# EasyEDA Pro project ProPrj_Arduino_Contest_2025_2025-11-19.epro, board Sensor_Module_Rev_2
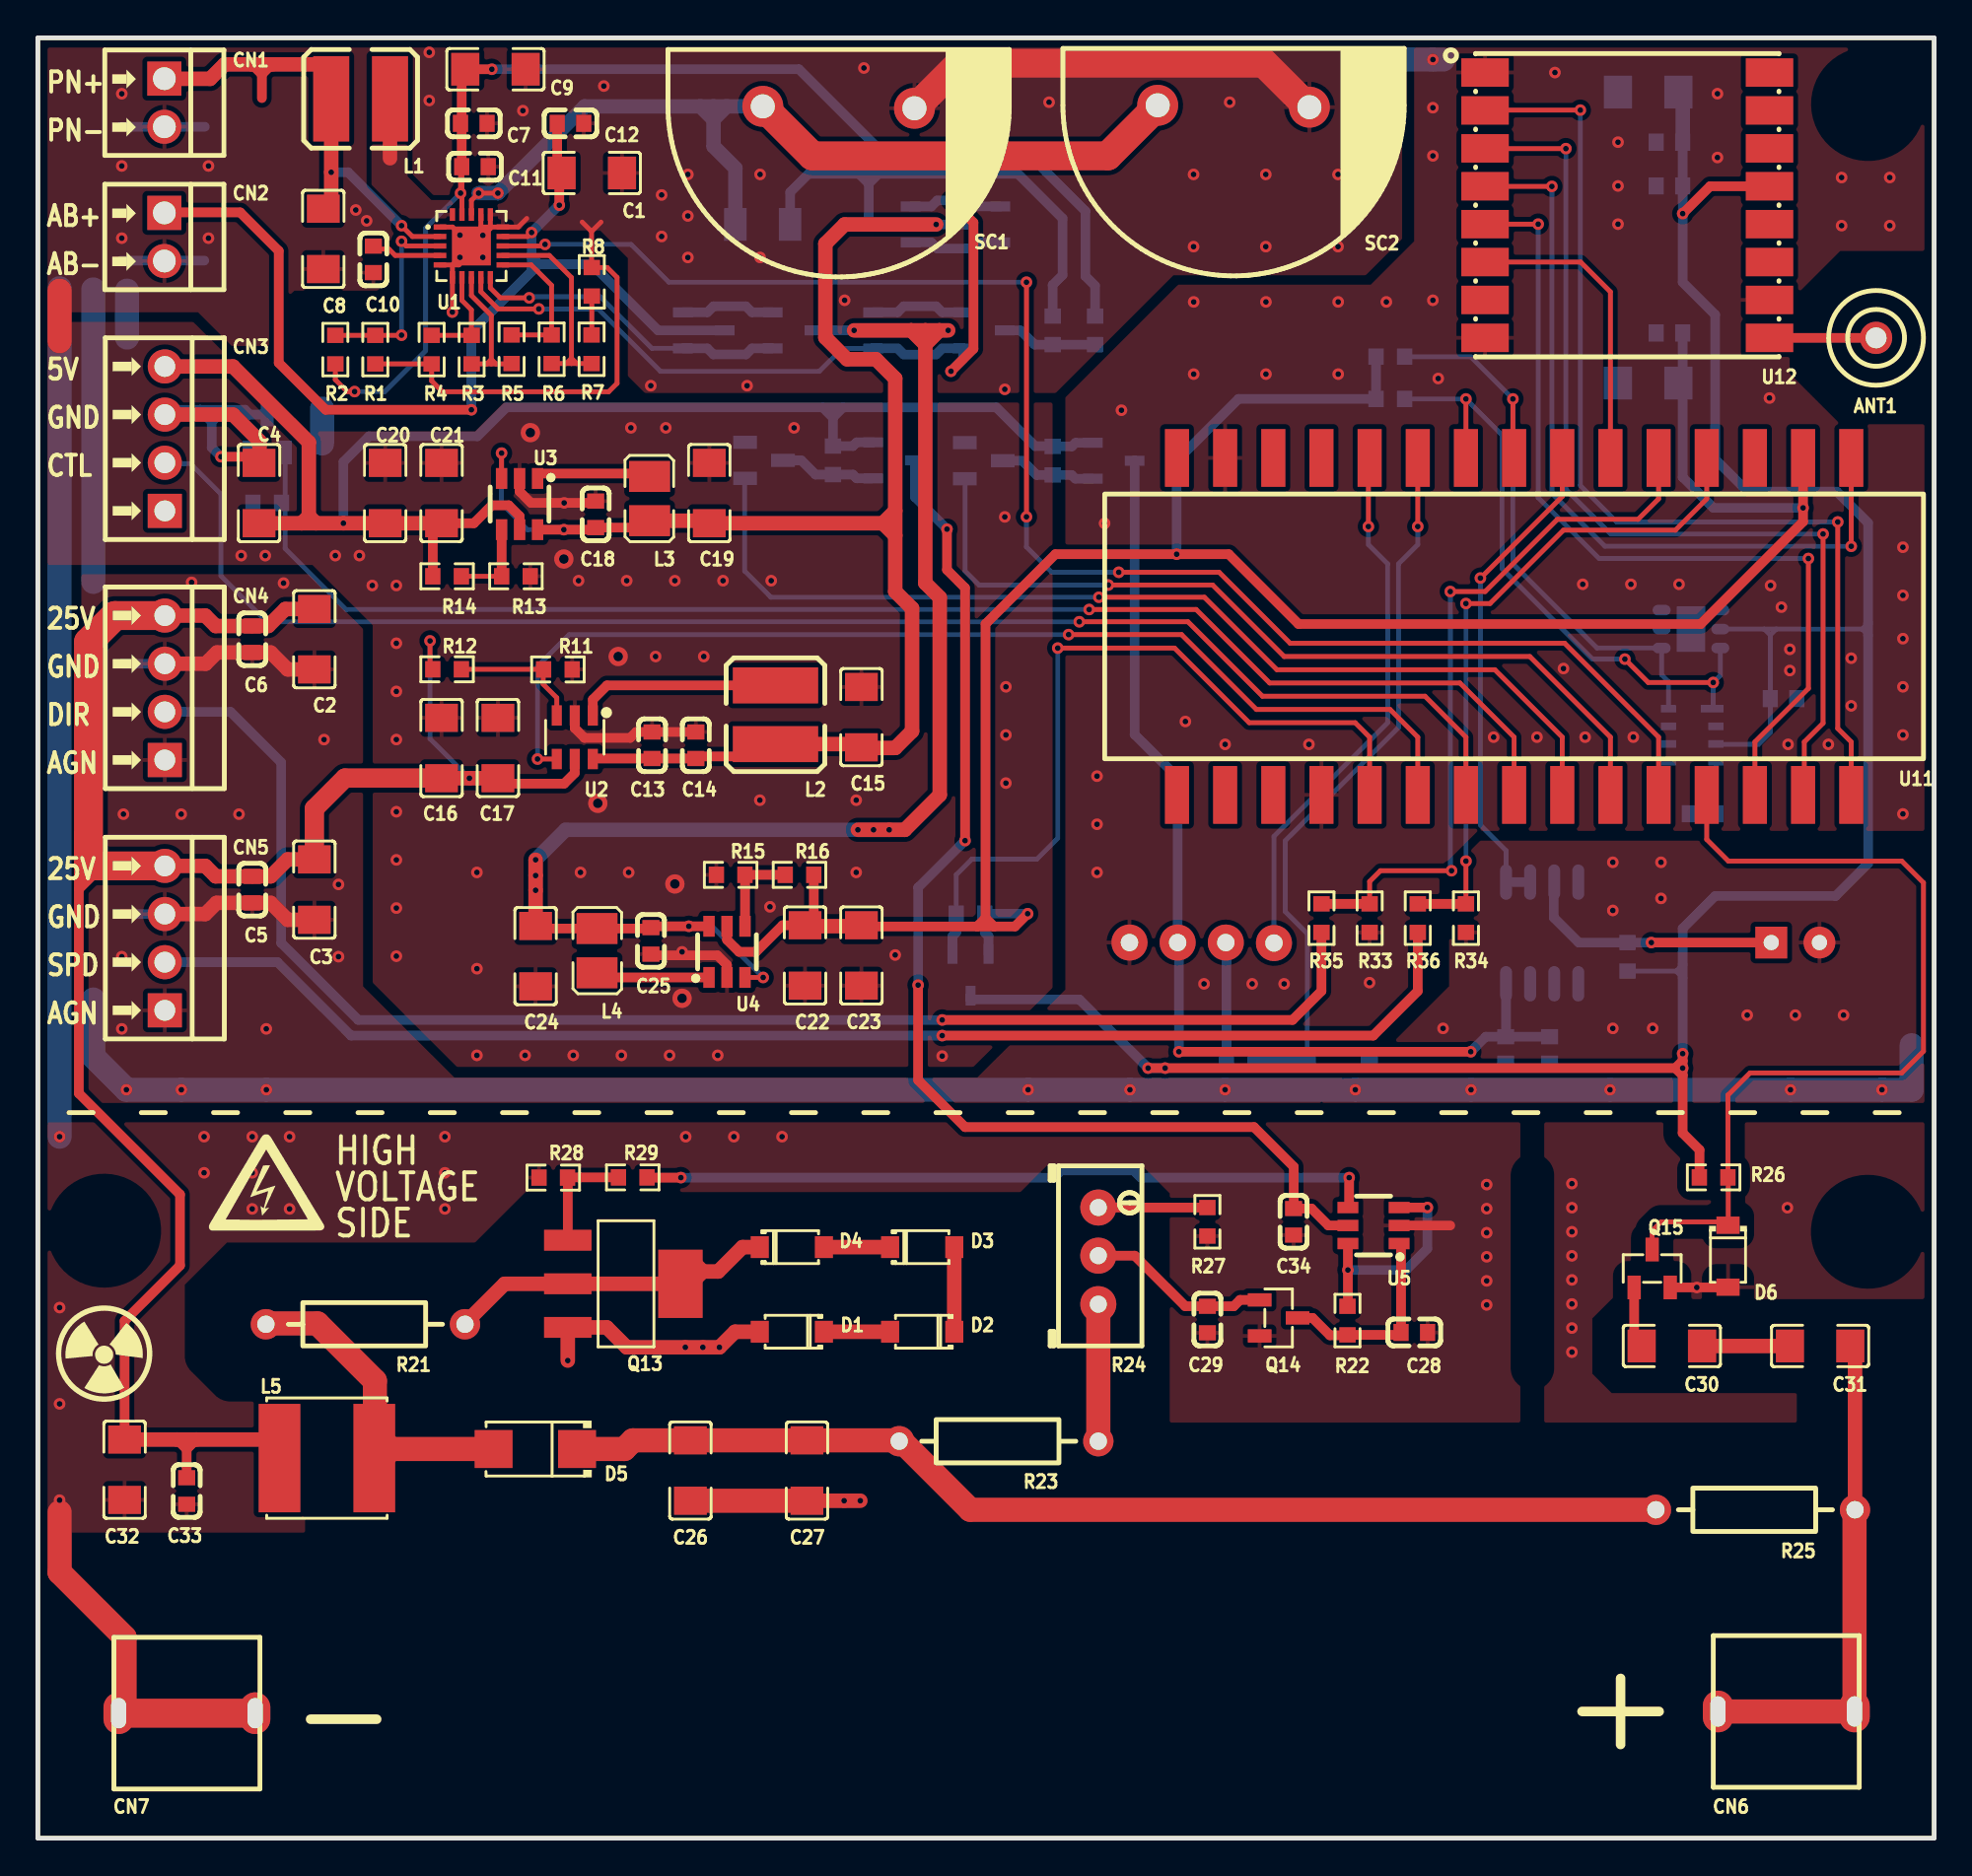
[diagram p21: board, top side]
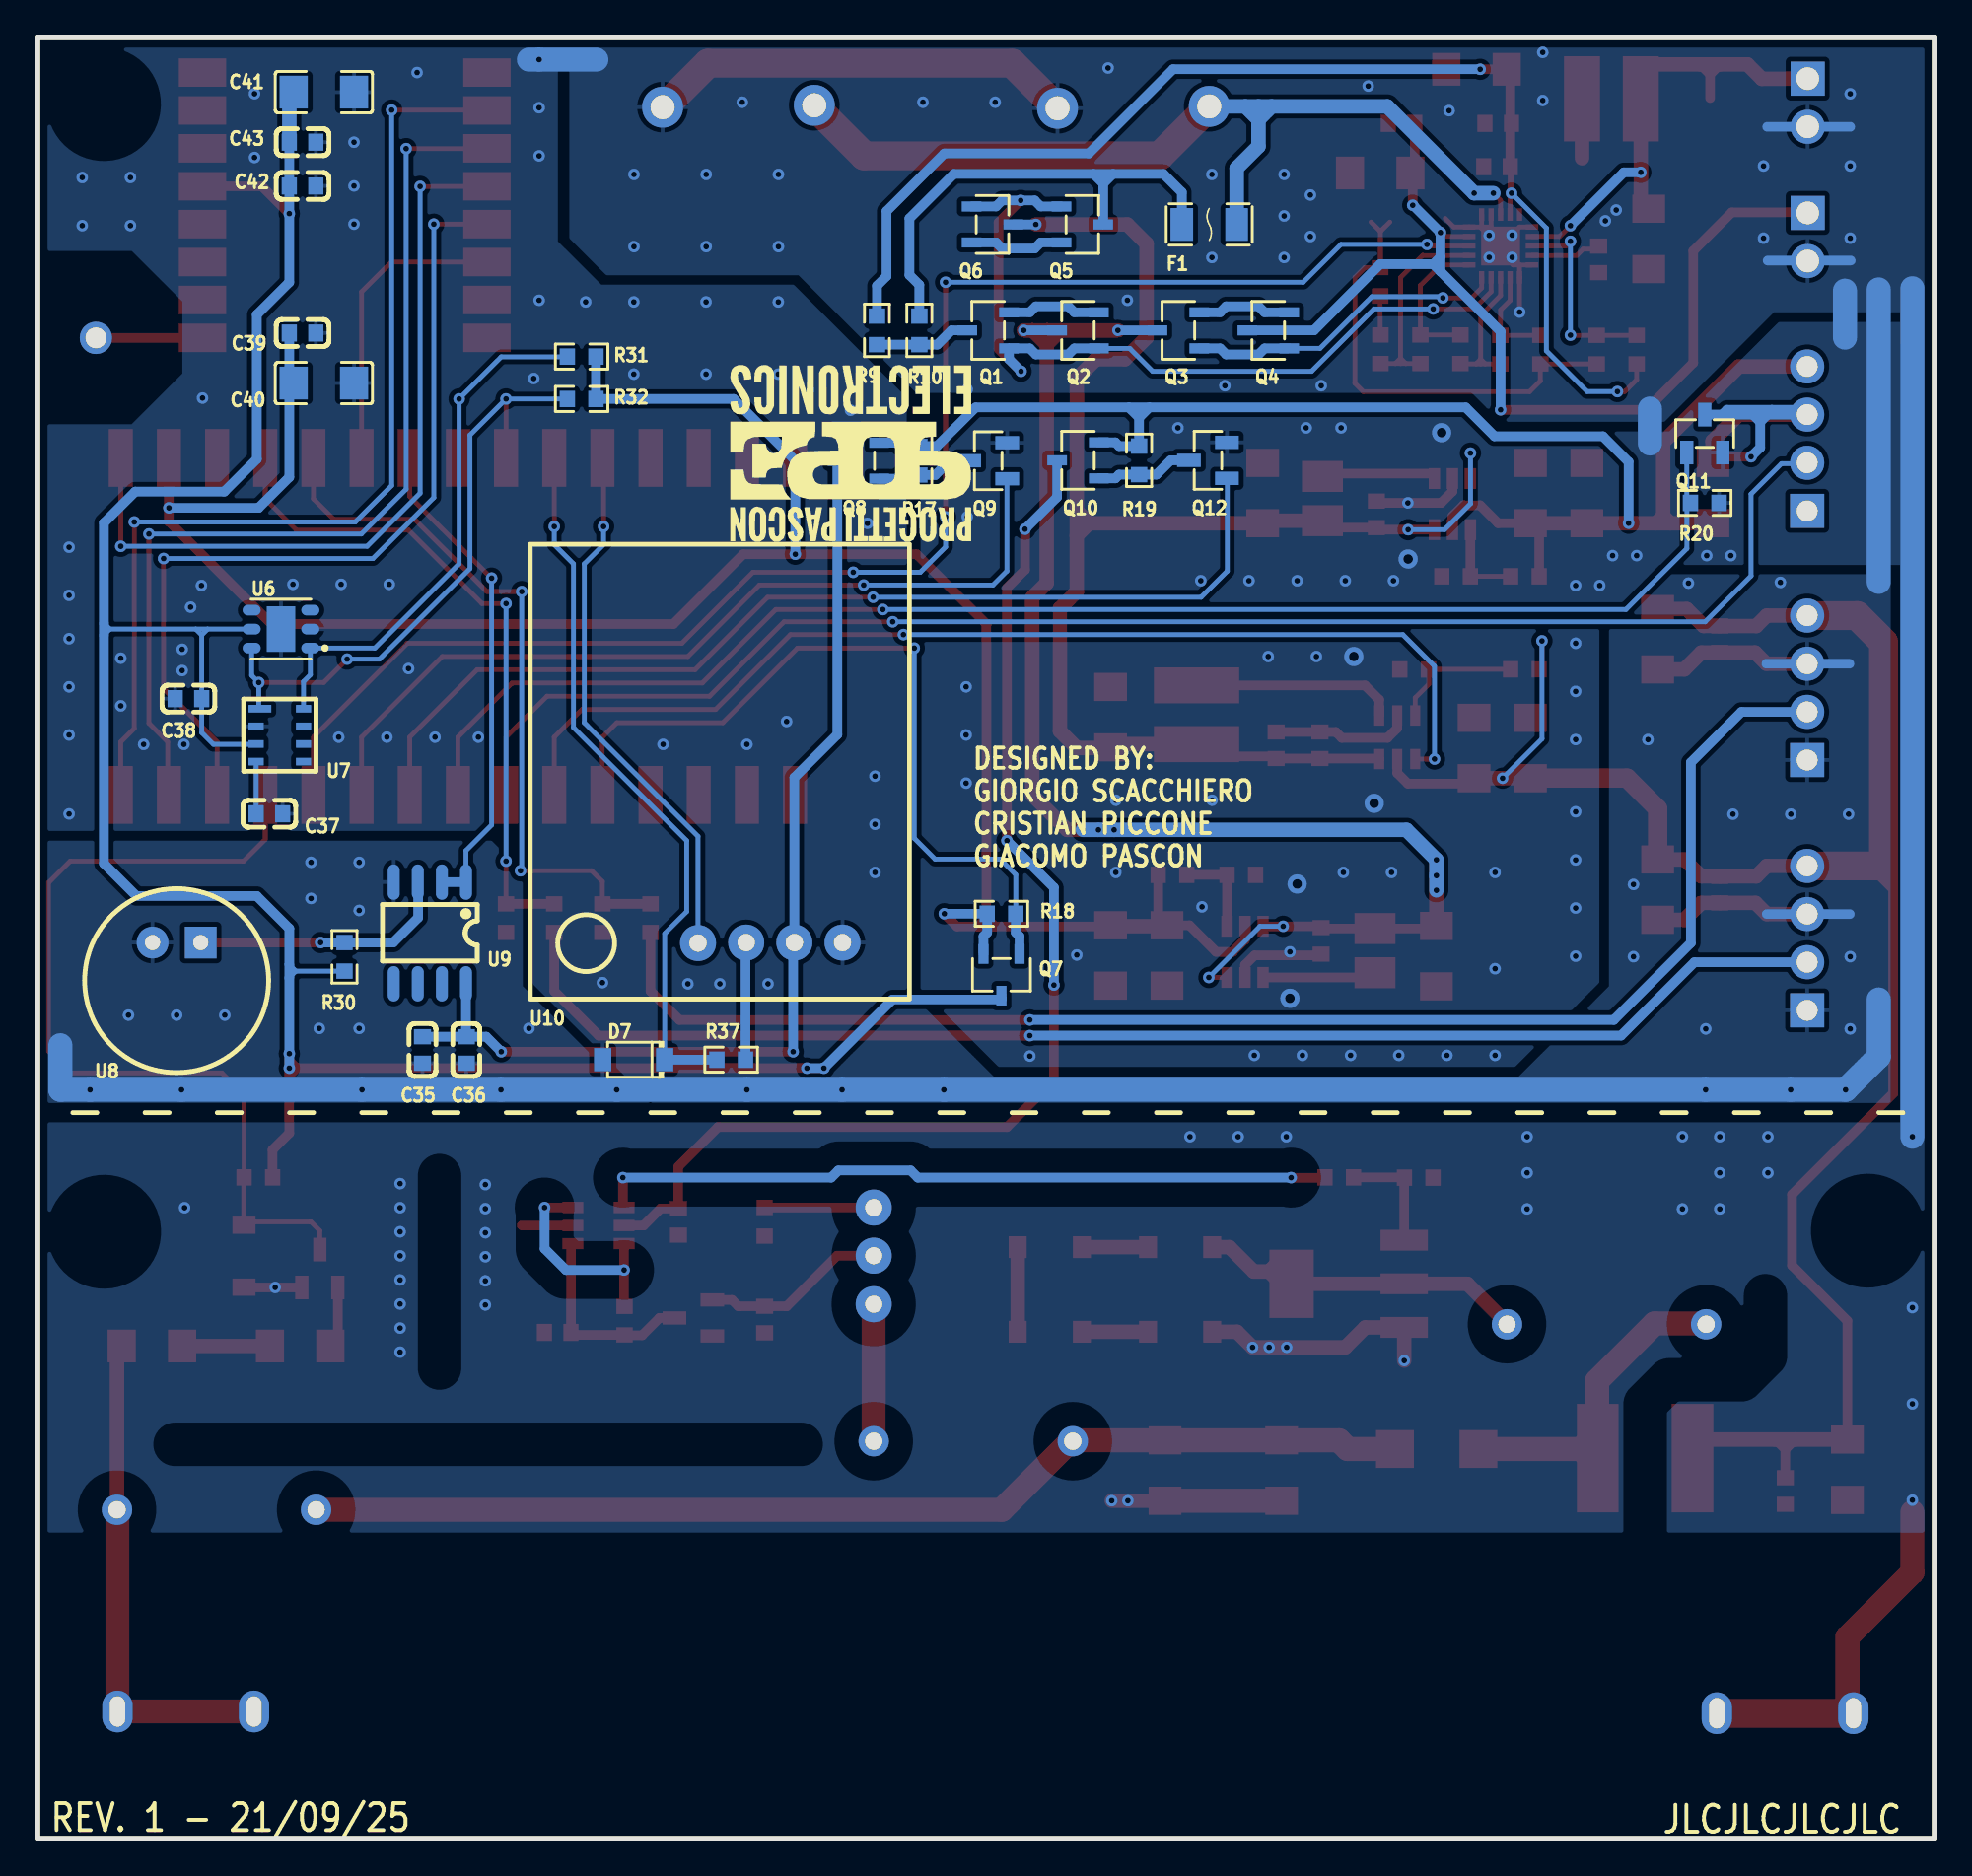
[diagram p22: board, bottom side, seen from below]

Outline 100 x 94.98 mm; copper layers: Top Layer, Bottom Layer. Coordinates in mm from the lower left corner of the outline.
Outline path: 0,94.98 100,94.98 100,0 0,0 0,94.98
Stack: Top Layer 0.035mm / Dielectric1 1.51mm FR4 er 4.5 / Bottom Layer 0.035mm

## Design rules (mm)
template: Custom Config
spacing copperThickness1oz (default): track to track 0.152, other pairs 0.152 to 0.3
spacing copperThickness2oz: track to track 0.203, other pairs 0.152 to 0.3
track width copperThickness1oz (default): min 0.127, default 0.254, max 2.54
track width copperThickness2oz: min 0.203, default 0.254, max 2.54
differential pair differentialPair (default): width min 0.127, default 0.254, max 2.54; gap min 0.152, default 0.152
via viaSize (default): diameter min 0.305, default 0.61, max 10.16; hole min 0.152, default 0.305, max 9.779
net $2N7577 uses traceRegion
pour e1770 uses Geiger_Logic_Copper
pour e2021 uses Geiger_Power_Copper

## Placement (name value [footprint] x y rotation side)
ANT1  VG868SNX18-5W2  [ANT-TH_VG868SNX18-5W2]  96.94 79.16 0 top
C1  4.7uF  [C1206]  29.21 87.86 180 top
C2  4.7uF  [C1206]  14.58 63.26 90 top
C3  4.7uF  [C1206]  14.58 50.04 90 top
C4  4.7uF  [C1206]  11.66 70.97 270 top
C5  100nF  [C0603]  11.3 50.04 90 top
C6  100nF  [C0603]  11.3 63.26 90 top
C7  100nF  [C0603]  22.99 90.47 180 top
C8  4.7uF  [C1206]  15.05 84.38 90 top
C9  4.7uF  [C1206]  24.13 93.33 180 top
C10  100pF  [C0603]  17.69 83.3 270 top
C11  100pF  [C0603]  23.05 88.19 180 top
C12  100pF  [C0603]  28.09 90.47 0 top
C13  100pF  [C0603]  32.39 57.66 270 top
C14  100nF  [C0603]  34.7 57.66 270 top
C15  4.7uF  [C1206]  43.43 59.14 270 top
C16  4.7uF  [C1206]  21.29 57.51 270 top
C17  4.7uF  [C1206]  24.26 57.51 270 top
C18  100nF  [C0603]  29.41 69.85 270 top
C19  4.7uF  [C1206]  35.41 70.97 270 top
C20  4.7uF  [C1206]  18.31 70.97 270 top
C21  4.7uF  [C1206]  21.29 70.97 270 top
C22  4.7uF  [C1206]  40.46 46.57 90 top
C23  4.7uF  [C1206]  43.43 46.57 90 top
C24  4.7uF  [C1206]  26.25 46.53 90 top
C25  100nF  [C0603]  32.33 47.34 90 top
C26  1nF  [C1206]  34.41 19.39 90 top
C27  1nF  [C1206]  40.56 19.39 90 top
C28  10pF  [C0603]  72.59 26.68 180 top
C29  100pF  [C0603]  61.68 27.36 90 top
C30  10pF  [C1206]  86.17 25.97 0 top
C31  10pF  [C1206]  93.99 25.97 0 top
C32  4.7uF  [C1206]  4.57 19.44 90 top
C33  100nF  [C0603]  7.84 18.31 90 top
C34  100nF  [C0603]  66.22 32.52 90 top
C35  100nF  [C0603]  79.72 41.58 90 bottom
C36  100pF  [C0603]  77.41 41.58 90 bottom
C37  100nF  [C0603]  87.79 54.05 0 bottom
C38  100nF  [C0603]  92.06 60.12 180 bottom
C39  100nF  [C0603]  86.04 79.41 180 bottom
C40  4.7uF  [C1206]  84.92 76.77 180 bottom
C41  4.7uF  [C1206]  84.92 92.12 0 bottom
C42  100pF  [C0603]  86.04 87.17 0 bottom
C43  100nF  [C0603]  86.04 89.48 0 bottom
CN1  DB125-2.54-2P-GN-S  [CONN-TH_DB125-2.54-2P-GN]  6.67 91.56 270 top
CN2  DB125-2.54-2P-GN-S  [CONN-TH_DB125-2.54-2P-GN]  6.67 84.48 270 top
CN3  DB125-2.54-4P-GN-S  [CONN-TH_DB125-2.54-4P-GN]  6.69 73.84 90 top
CN4  DB125-2.54-4P-GN-S  [CONN-TH_DB125-2.54-4P-GN]  6.69 60.69 90 top
CN5  DB125-2.54-4P-GN-S  [CONN-TH_DB125-2.54-4P-GN]  6.69 47.49 90 top
CN6  XF-007  [FUSE-TH_XF-007]  92.2 6.68 180 top
CN7  XF-007  [FUSE-TH_XF-007]  7.86 6.59 0 top
D1  BZD27C200P  [SOD-123_L2.8-W1.8-LS3.7-RD]  39.76 26.72 180 top
D2  BZD27C200P  [SOD-123_L2.8-W1.8-LS3.7-RD]  46.64 26.72 180 top
D3  BZD27C200P  [SOD-123_L2.8-W1.8-LS3.7-RD]  46.64 31.18 0 top
D4  BZD27C200P  [SOD-123_L2.8-W1.8-LS3.7-RD]  39.76 31.18 0 top
D5  RS1M  [SMA_L4.3-W2.6-LS5.2-RD]  26.23 20.53 180 top
D6  BZT52C3V3  [SOD-123_L2.7-W1.6-LS3.7-RD]  89.13 30.7 270 top
D7  BZT52C3V3  [SOD-123_L2.7-W1.6-LS3.7-RD]  68.58 41.07 0 bottom
F1  CFS12V3T2R50  [F1206]  38.23 85.14 0 bottom
L1  22uH  [IND-SMD_L4.5-W4.0]  17.02 91.77 0 top
L2  22uH  [IND-SMD_L4.5-W4.0]  38.9 59.27 270 top
L3  2.2uH  [L1008]  32.26 70.68 90 top
L4  2.2uH  [L1008]  29.49 46.82 270 top
L5  1mH  [IND-SMD_L6.0-W6.0]  15.24 20.05 0 top
Q1  DO2301E-Q  [SOT-23-3_L3.0-W1.7-P0.95-LS2.9-BR]  49.89 79.55 180 bottom
Q2  DO2301E-Q  [SOT-23-3_L3.0-W1.7-P0.95-LS2.9-BR]  45.15 79.55 180 bottom
Q3  DO2301E-Q  [SOT-23-3_L3.0-W1.7-P0.95-LS2.9-BR]  39.85 79.55 180 bottom
Q4  DO2301E-Q  [SOT-23-3_L3.0-W1.7-P0.95-LS2.9-BR]  35.11 79.55 180 bottom
Q5  DO2301E-Q  [SOT-23-3_L3.0-W1.7-P0.95-LS2.9-BR]  44.92 85.14 0 bottom
Q6  DO2301E-Q  [SOT-23-3_L3.0-W1.7-P0.95-LS2.9-BR]  49.66 85.14 0 bottom
Q7  DO2301E-Q  [SOT-23-3_L3.0-W1.7-P0.95-LS2.9-BR]  49.18 45.55 90 bottom
Q8  DO2301E-Q  [SOT-23-3_L3.0-W1.7-P0.95-LS2.9-BR]  56.74 72.67 180 bottom
Q9  5N10-MS  [SOT-23-3_L2.9-W1.3-P1.90-LS2.4-BL-1]  49.88 72.67 90 bottom
Q10  DO2301E-Q  [SOT-23-3_L3.0-W1.7-P0.95-LS2.9-BR]  45.15 72.69 180 bottom
Q11  5N10-MS  [SOT-23-3_L2.9-W1.3-P1.90-LS2.4-BL-1]  12.09 74.11 180 bottom
Q12  5N10-MS  [SOT-23-3_L2.9-W1.3-P1.90-LS2.4-BL-1]  38.29 72.69 90 bottom
Q13  SP05N100TC  [SOT-223-3_L6.5-W3.4-P2.30-LS7.0-BR-1]  30.91 29.25 180 top
Q14  5N10-MS  [SOT-23-3_L2.9-W1.3-P1.90-LS2.4-BL-1]  65.43 27.45 270 top
Q15  S8050-J3Y  [SOT-23-3_L2.9-W1.3-P0.95-LS2.4-BR-1]  85.13 30.05 270 top
R1  0Ω  [R0603]  17.79 78.54 90 top
R2  0Ω  [R0603]  15.68 78.54 270 top
R3  4.12MΩ  [R0603]  22.87 78.54 90 top
R4  7.87MΩ  [R0603]  20.76 78.54 270 top
R5  1.5MΩ  [R0603]  24.98 78.56 270 top
R6  3.9MΩ  [R0603]  27.09 78.56 90 top
R7  3.32MΩ  [R0603]  29.2 78.56 90 top
R8  3.32MΩ  [R0603]  29.21 82.11 90 top
R9  0Ω  [R0603]  55.75 79.55 270 bottom
R10  0Ω  [R0603]  53.52 79.55 270 bottom
R11  75kΩ  [R0603]  27.42 61.66 180 top
R12  2.32MΩ  [R0603]  21.58 61.67 180 top
R13  100kΩ  [R0603]  25.21 66.58 180 top
R14  887kΩ  [R0603]  21.58 66.58 180 top
R15  82kΩ  [R0603]  36.53 50.82 0 top
R16  453kΩ  [R0603]  40.16 50.82 0 top
R17  1MΩ  [R0603]  53.52 72.67 270 bottom
R18  1MΩ  [R0603]  49.18 48.77 180 bottom
R19  1MΩ  [R0603]  41.93 72.69 270 bottom
R20  1MΩ  [R0603]  12.09 70.45 180 bottom
R21  100Ω  [RES-TH_BD2.2-L6.5-P10.50-D0.6]  17.27 27.11 180 top
R22  1MΩ  [R0603]  69.06 27.3 90 top
R23  10MΩ  [RES-TH_BD2.2-L6.5-P10.50-D0.6]  50.67 20.94 180 top
R24  100kΩ  [RES-ADJ-TH_3P-L9.5-W4.9-P2.50-L_3296W]  55.92 30.72 270 top
R25  10MΩ  [RES-TH_BD2.2-L6.5-P10.50-D0.6]  90.58 17.32 180 top
R26  100kΩ  [R0603]  88.37 34.86 180 top
R27  0Ω  [R0603]  61.68 32.52 90 top
R28  1MΩ  [R0603]  27.18 34.85 180 top
R29  0Ω  [R0603]  31.37 34.86 0 top
R30  2.2kΩ  [R0603]  83.83 46.5 270 bottom
R31  100kΩ  [R0603]  71.32 78.17 180 bottom
R32  100kΩ  [R0603]  71.32 75.93 180 bottom
R33  33kΩ  [R0603]  70.23 48.54 90 top
R34  33kΩ  [R0603]  75.31 48.54 90 top
R35  17.4kΩ  [R0603]  67.69 48.54 270 top
R36  17.4kΩ  [R0603]  72.77 48.54 270 top
R37  330Ω  [R0603]  63.44 41.07 180 bottom
SC1  -  [BIGCAP_BUP002R8L107FA]  42.23 91.37 0 top
SC2  -  [BIGCAP_BUP002R8L107FA]  63.06 91.43 0 top
U1  BQ25505RGRR  [VQFN-20_L3.5-W3.5-P0.50-TL-EP]  22.86 84 0 top
U2  TLV61046ADBVR  [SOT-23-6_L2.9-W1.6-P0.95-LS2.8-BL]  28.31 58.08 180 top
U3  TLV61070ADBVR  [SOT-23-6_L2.9-W1.6-P0.95-LS2.8-BR]  25.4 70.39 90 top
U4  TLV61070ADBVR  [SOT-23-6_L2.9-W1.6-P0.95-LS2.8-BR]  36.34 46.76 270 top
U5  SN74LVC2G14DBVR  [SOT-23-6_L2.9-W1.6-P0.95-LS2.8-BR]  70.44 32.32 0 top
U6  HDC1080DMBR  [SENSOR-SMD_HDC1080DMBR]  87.18 63.79 0 bottom
U7  WF183DE 15BA L8B T&R  [LGA-8_L3.8-W3.8-P0.93-BL]  87.24 58.19 180 bottom
U8  GMI9745P-48DB  [MIC-TH_BD9.7-P2.54-D0.8-L-FD]  92.68 47.25 0 bottom
U9  BA4558F-E2  [SOP-8_L4.9-W3.9-P1.27-LS6.0-BL]  79.33 47.76 0 bottom
U10  -  [Saiya_SYP16]  54.04 44.27 90 bottom
U11  -  [Arduino_NANO_ESP32]  96.27 71.55 270 top
U12  868MHz  [COMM-SMD_LORA1276-C1-915MHZ]  83.82 86.16 0 top

## Footprints (pads in the part's own frame, mm; a bottom-side part is the same pattern mirrored in y, then rotated)
ANT-TH_VG868SNX18-5W2
  round 1.7 hole 1.1: 1(0,0)
Arduino_NANO_ESP32
  rect 3.048x1.27 smd: 1(-1.27,-0.635) 2(-1.27,-3.175) 3(-1.27,-5.715) 4(-1.27,-8.255) 5(-1.27,-10.795) 6(-1.27,-13.335) 7(-1.27,-15.875) 8(-1.27,-18.415) 9(-1.27,-20.955) 10(-1.27,-23.495) 11(-1.27,-26.035) 12(-1.27,-28.575) 13(-1.27,-31.115) 14(-1.27,-33.655) 15(-1.27,-36.195) 16(16.51,-0.635) 17(16.51,-3.175) 18(16.51,-5.715) 19(16.51,-8.255) 20(16.51,-10.795) 21(16.51,-13.335) 22(16.51,-15.875) 23(16.51,-18.415) 24(16.51,-20.955) 25(16.51,-23.495) 26(16.51,-26.035) 27(16.51,-28.575) 28(16.51,-31.115) 29(16.51,-33.655) 30(16.51,-36.195)
BIGCAP_BUP002R8L107FA
  round 2.159 hole 1.27: 1(-4,0) 2(4,-0.1)
C0603
  rect 0.8x0.9 smd: 1(-0.7,0) 2(0.7,0)
C1206
  rect 1.485x1.728 smd: 1(-1.593,0) 2(1.593,0)
COMM-SMD_LORA1276-C1-915MHZ
  rect 2.5x1.5 smd: 1(-7.5,7) 2(-7.5,5) 3(-7.5,3) 4(-7.5,1) 5(-7.5,-1) 6(-7.5,-3) 7(-7.5,-5) 8(-7.5,-7) 9(7.5,-7) 10(7.5,-5) 11(7.5,-3) 12(7.5,-1) 13(7.5,1) 14(7.5,3) 15(7.5,5) 16(7.5,7)
CONN-TH_DB125-2.54-2P-GN
  rect 1.8x1.8 hole 1.2: 1(-1.27,0)
  round 1.8 hole 1.2: 2(1.27,0)
CONN-TH_DB125-2.54-4P-GN
  rect 1.8x1.8 hole 1.1: 1(-3.81,0)
  round 1.8 hole 1.1: 2(-1.27,0) 3(1.27,0) 4(3.81,0)
F1206
  rect 1.19x1.728 smd: 1(-1.445,0) 2(1.445,0)
FUSE-TH_XF-007
  oval 1.6x2.2 hole 0.8x1.6: 1(-3.6,0) 1(3.6,0)
IND-SMD_L4.5-W4.0
  rect 1.9x4.5 smd: 1(-1.55,0) 2(1.55,0)
IND-SMD_L6.0-W6.0
  rect 2.2x5.72 smd: 1(-2.5,0) 2(2.5,0)
L1008
  rect 1.635x2.16 smd: 1(-1.167,0) 2(1.167,0)
LGA-8_L3.8-W3.8-P0.93-BL
  rect 1.2x0.4 smd: 1(-1.05,1.395)
  rect 0.8x0.4 smd: 2(-1.25,0.465) 3(-1.25,-0.465) 4(-1.25,-1.395) 5(1.25,-1.395) 6(1.25,-0.465) 7(1.25,0.465) 8(1.25,1.395)
MIC-TH_BD9.7-P2.54-D0.8-L-FD
  rect 1.677x1.677 hole 0.8: 1(-1.27,0)
  round 1.677 hole 0.8: 2(1.27,0)
R0603
  rect 0.806x0.864 smd: 1(-0.753,0) 2(0.753,0)
RES-ADJ-TH_3P-L9.5-W4.9-P2.50-L_3296W
  round 1.9 hole 0.9: 1(-2.55,0) 2(-0.01,0) 3(2.55,0)
RES-TH_BD2.2-L6.5-P10.50-D0.6
  round 1.6 hole 0.914: 1(-5.25,0) 2(5.25,0)
Saiya_SYP16
  round 1.9 hole 0.914x0.9: 1(2.955,11.15) 2(2.981,8.611) 3(2.981,6.071) 4(2.981,3.53)
SENSOR-SMD_HDC1080DMBR
  oval 0.95x0.56 smd: 1(-1.548,1) 2(-1.548,0) 3(-1.548,-1) 4(1.548,-1) 5(1.548,0) 6(1.548,1)
  rect 1.5x2.4 smd: 7(0,0)
SMA_L4.3-W2.6-LS5.2-RD
  rect 2x2 smd: 1(-2.2,0) 2(2.2,0)
SOD-123_L2.7-W1.6-LS3.7-RD
  rect 0.91x1.22 smd: 1(-1.635,0) 2(1.635,0)
SOD-123_L2.8-W1.8-LS3.7-RD
  rect 0.95x1.15 smd: 1(-1.692,0) 2(1.692,0)
SOP-8_L4.9-W3.9-P1.27-LS6.0-BL
  oval 0.63x1.865 smd: 1(-1.905,-2.683) 2(-0.635,-2.683) 3(0.635,-2.683) 4(1.905,-2.683) 5(1.905,2.683) 6(0.635,2.683) 7(-0.635,2.683) 8(-1.905,2.683)
SOT-23-3_L2.9-W1.3-P0.95-LS2.4-BR-1
  rect 1.25x0.7 smd: 1(1,-0.95) 2(1,0.95) 3(-1,0)
SOT-23-3_L2.9-W1.3-P1.90-LS2.4-BL-1
  rect 0.7x1.25 smd: 1(-0.95,-1) 2(0.95,-1) 3(0,1)
SOT-23-3_L3.0-W1.7-P0.95-LS2.9-BR
  rect 1.038x0.532 smd: 1(1.101,-0.95) 2(1.101,0.95) 3(-1.101,0)
SOT-23-6_L2.9-W1.6-P0.95-LS2.8-BL
  rect 0.532x1.072 smd: 1(-0.95,-1.149) 2(0,-1.149) 3(0.95,-1.149) 4(0.95,1.149) 5(0,1.149) 6(-0.95,1.149)
SOT-23-6_L2.9-W1.6-P0.95-LS2.8-BR
  rect 1.1x0.6 smd: 1(1.35,-0.95) 2(1.35,0) 3(1.35,0.95) 4(-1.35,0.95) 5(-1.35,0) 6(-1.35,-0.95)
SOT-223-3_L6.5-W3.4-P2.30-LS7.0-BR-1
  rect 2.5x1.1 smd: 1(2.97,-2.3) 2(2.97,0) 3(2.97,2.3)
  rect 2.34x3.6 smd: 2(-2.97,0)
VQFN-20_L3.5-W3.5-P0.50-TL-EP
  rect 0.665x0.28 smd: 1(-1.657,1) 2(-1.657,0.5) 3(-1.657,0) 4(-1.657,-0.5) 5(-1.657,-1) 11(1.657,-1) 12(1.657,-0.5) 13(1.657,0) 14(1.657,0.5) 15(1.657,1)
  rect 0.28x0.665 smd: 6(-1,-1.657) 7(-0.5,-1.657) 8(0,-1.657) 9(0.5,-1.657) 10(1,-1.657) 16(1,1.657) 17(0.5,1.657) 18(0,1.657) 19(-0.5,1.657) 20(-1,1.657)
  rect 2.05x2.05 smd: 21(0,0)

## Nets
As in the schematic, except:
+5V: C4.2 C20.2 C21.2 CN3.4 Q8.2 Q10.2 R14.2 R17.1 R19.1 U3.5
LOGIC_VCC_UNREG: C24.2 C25.2 L4.1 Q2.3 Q3.3 U4.3 U4.6
$7N615: Q8.1 Q9.3 R17.2
$7N629: Q10.1 Q12.3 R19.2

Pads without a net: CN3 1; U6 3 4; U7 5 6 7; U9 5 6 7; U11 3 12 13 15 28 29 30; U12 7 11 12 14 15 16

## Via types
v1: diameter 0.61, hole 0.305, Top Layer to Bottom Layer, 293 vias
v2: diameter 1.016, hole 0.508, Top Layer to Bottom Layer, 6 vias

## Routing (per net, layer and track width the routed paths; a pad name or vN(x,y) marks a point on that pad's centre or on a via; arc(x,y) is an arc through that point)
3V3_SW_EN: length 41.9
  Top Layer w0.254: v1(53.78,62.79) 59.94,62.79 63.88,58.85 69.47,58.85 70.23,58.09 U11.26
  Bottom Layer w0.254: R18.2 48.43,50.83 49.26,51.66 52.68,51.66 53.78,52.76 v1(53.78,62.79)
  Bottom Layer w0.508: Q7.1 48.23,46.65 48.23,47.58 48.43,47.78 R18.2
5V_GEIG_EN: length 54.7
  Top Layer w0.254: v1(55.95,65.47) 61.52,65.47 65.34,61.65 76.84,61.65 80.39,58.09 U11.22
  Bottom Layer w0.254: Q12.1 37.27,71.72 37.27,66.85 38.66,65.47 v1(55.95,65.47)
5V_SENS_EN: length 45.6
  Top Layer w0.254: 82.93,55.04 82.93,58.09 78.68,62.34 65.72,62.34 61.95,66.12 v1(56.45,66.12)
  Bottom Layer w0.254: 48.88,71.74 48.9,71.73 48.9,66.85 49.63,66.12 v1(56.45,66.12)
25V_EN: length 58.3
  Top Layer w0.254: v1(54.36,63.5) 60.31,63.5 64.26,59.55 71.31,59.55 72.77,58.09 U11.25 ; 27.36,56.94 v1(26.35,56.94)
  Bottom Layer w0.254: v1(54.36,63.5) 28.02,63.5 26.35,61.83 v1(26.35,56.94)
+3V3: length 127.5
  Top Layer w0.508: U4.5 36.34,47.4 36.98,46.76 37.87,46.76 39.27,48.16 C22.2 40.92,48.62 R16.2 ; 49.53,48.1 49.97,48.54 ; 49.53,48.1 50.42,48.1 ; 49.53,48.1 43.49,48.1 C23.2 ; 49.97,48.54 49.97,64.06 53.66,67.74 v1(60.06,67.74) 62.8,67.74 66.48,64.06 87.69,64.06 93.09,69.46 v1(93.09,70.19) 93.09,72.82 ; 49.97,48.54 50.42,48.1 ; 50.42,48.1 51.52,48.1 v1(52.2,48.77)
  Top Layer w0.762: C22.2 40.5,48.12 43.38,48.12 C23.2
  Bottom Layer w0.508: Q7.2 50.13,47.58 49.94,47.78 R18.1 v1(52.2,48.77) ; C39.1 86.74,77 C40.1 86.74,76.54 86.74,71.81 88.36,70.19 v1(93.09,70.19) ; v1(60.06,67.74) 60.06,72.68 63.31,75.93 R32.2 R31.2
+3V3SW: length 140.6
  Top Layer w0.508: 86.36,40.63 86.74,41.01 ; 86.36,40.63 86.74,40.24 ; 86.36,40.63 v1(86.74,40.63) ; 86.36,40.63 v1(59.45,40.63) v1(58.55,40.63) ; 86.74,41.01 v1(86.74,40.63) ; 86.74,41.01 v1(86.74,41.39) ; v1(86.74,40.63) 86.74,40.24 ; 86.74,40.24 86.74,37.2 87.63,36.31 87.63,34.87 87.62,34.86 ; U12.13 88.19,87.16 v1(86.74,85.71)
  Bottom Layer w0.254: 91.36,63.48 91.05,63.79 ; 91.36,63.48 91.68,63.79 ; 91.36,63.48 C38.2 91.36,58.33 90.74,57.71 88.51,57.71 U7.3 ; 91.05,63.79 91.68,63.79 ; 91.05,63.79 U6.5 ; 91.68,63.79 96.2,63.79 ; 96.2,63.79 96.52,64.11 ; 96.2,63.79 96.52,63.48 ; 86.4,45.74 86.74,46.09 ; 86.4,45.74 86.74,45.4 ; 86.4,45.74 R30.2
  Bottom Layer w0.508: v1(86.74,40.63) v1(86.74,41.39) 86.74,47.99 88.46,49.71 94.81,49.71 96.52,51.42 96.52,69.39 94.87,71.04 90.17,71.04 88.46,72.76 88.46,80.38 86.74,82.09 v1(86.74,85.71) C42.2 C43.2 ; v1(59.45,40.63) v1(58.55,40.63) 54.93,44.25 49.18,44.25 Q7.3
  Bottom Layer w0.762: C41.2 86.74,91.89 C43.2
+5V: length 82.4
  Top Layer w0.508: U3.5 25.4,69.75 24.83,70.32 23.94,70.32 22.99,69.38 C21.2 20.83,68.91 20.83,66.58
  Top Layer w0.762: CN3.4 10.29,77.65 14.29,73.65 14.29,69.76 ; C21.2 C20.2 v1(16.11,69.38) 14.67,69.38 ; 13.91,69.38 14.67,69.38 ; 13.91,69.38 14.29,69.76 ; 13.91,69.38 C4.2 ; 14.67,69.38 14.29,69.76
  Bottom Layer w0.508: R17.1 54.53,73.43 54.73,73.62 Q8.2 ; 42.47,75.49 50.55,75.49 52.59,73.45 53.52,73.45 ; 42.47,75.49 41.93,74.95 ; 42.47,75.49 41.39,75.49 ; 41.93,74.95 R19.1 42.98,73.45 43.18,73.64 Q10.2 ; 41.93,74.95 41.39,75.49 ; 41.39,75.49 24.7,75.49 23.18,73.96 17.46,73.96 16.11,72.61 v1(16.11,69.38)
+5V_GEIG: length 62
  Top Layer w0.508: U5.5 68.06,32.32 67.16,33.22 C34.2 66.23,33.23 66.23,35.42 64.13,37.52 48.9,37.52 46.42,39.99 v1(46.42,45.01) ; v1(47.94,69.06) 47.94,66.92 48.9,65.96 v1(48.9,52.63)
  Bottom Layer w0.508: Q10.3 46.25,70.75 v1(47.94,69.06) ; v1(48.9,52.63) 46.42,50.15 v1(46.42,45.01)
+5V_SENS: length 54.8
  Top Layer w0.508: v1(60.17,41.49) v1(75.56,41.49)
  Bottom Layer w0.508: v1(75.56,41.49) 76.36,42.28 C36.2 ; 57.84,72.69 57.84,58.23 60.11,55.96 U10.3 60.17,47.19 v1(60.17,41.49) ; C36.2 C35.2 ; C36.2 77.43,42.3 U9.8
+25V: length 114
  Top Layer w0.254: v1(20.68,63.17) 20.68,61.82 20.83,61.67
  Top Layer w0.508: U2.5 28.31,56.2 27.75,55.64 24.54,55.64 C17.2 ; 7.84,20.51 8.36,21.03 ; 7.84,20.51 C33.2 ; 7.84,20.51 7.33,21.03 ; 2.16,50.07 2.94,50.85 ; 2.16,50.07 2.16,53.07 ; 2.16,50.07 2.16,39.29 7.49,33.96 7.49,30.21 4.57,27.29 4.57,21.03
  Top Layer w0.762: C6.2 12.15,63.96 13.05,64.85 C2.2 ; C17.2 v1(22.76,55.92) C16.2 ; 12.22,19.45 12.22,21.03 4.57,21.03 ; C3.2 13.17,51.64 12.28,50.74 9.38,50.74 8.83,51.3 CN5.4 ; CN4.4 8.83,64.5 9.38,63.95 11.3,63.95
  Top Layer w1.016: C3.2 14.58,54.32 16.19,55.93 21.28,55.93 C16.2
  Top Layer w1.524: CN5.4 2.67,51.3 2.67,63.11 4.06,64.5 CN4.4
  Bottom Layer w0.254: v1(22.76,55.92) 20.68,58 v1(20.68,63.17)
GND: length 332.6
  Top Layer w0.254: U1.5 21.86,83 ; 21.86,83 U1.21 ; 21.86,83 22.2,83 22.86,83.66 U1.21 ; 21.86,83 U1.6 21.86,80.52 v1(21.86,80.52) ; 23.86,85 23.86,84.93 23.5,84.56 ; 23.86,85 U1.16 ; 23.86,85 U1.15 25.33,85 25.78,85.46 ; 23.86,85 23.39,85 ; U1.21 22.94,84 23.5,84.56 ; U1.21 21.86,85 U1.1 ; 29.2,84.77 29.2,82.88 R8.2 30.02,82.87 30.54,82.35 30.54,76.76 30.1,76.31 21.34,76.31 20.76,76.89 R4.2 R1.1 ; 29.2,84.77 29.7,85.27 ; 29.2,84.77 28.7,85.27 ; 23.5,84.56 23.5,84.9 23.39,85 ; U1.17 23.36,85.03 23.39,85
  Top Layer w0.508: 74.49,32.32 U5.2 ; 32.33,46.58 35.83,46.58 36.34,46.07 U4.2 ; C18.1 29.32,70.45 v1(27.75,70.45) 26,70.45 25.4,71.05 U3.2 ; C14.1 C13.1 31.55,58.36 31.24,58.05 28.82,58.05 28.31,58.56 U2.2 ; D6.2 89.12,29.05 v1(87.49,29.05) Q15.2
  Top Layer w0.762: 6.71,61.96 8.85,61.96 9.44,62.56 C6.1 12.28,62.56 13.17,61.66 C2.1 ; v1(27.94,25.2) Q13.3 30,26.95 31.05,25.9 v1(34.14,25.9) v1(35.07,25.9) v1(35.94,25.9) 36.76,26.72 38.07,26.72 ; v1(43.37,17.8) v1(42.52,17.8) C27.1 ; C3.1 13.17,48.45 12.28,49.34 C5.1 9.42,49.34 8.83,48.76 CN5.3
  Top Layer w1.27: CN7.1 4.57,6.9 4.57,10.59 1.14,14.02 1.14,17.2 ; C26.1 C27.1 ; 1.14,81.65 1.14,78.98
  Top Layer w1.524: 46.24,91.27 48.62,93.65 64.66,93.65 67.04,91.27 ; CN7.1 CN7.1
  Bottom Layer w0.508: 4.46,61.96 CN4.3 8.85,61.96 ; 8.83,48.76 CN5.3 4.44,48.76 ; 4.42,90.29 CN1.2 8.8,90.29 ; 8.78,83.24 4.39,83.24
  Bottom Layer w1.27: 74.1,93.84 v1(73.57,93.84) 70.55,93.84 ; 2.92,44.25 2.92,41.23 v1(4.67,39.48) v1(7.56,39.48) v1(12.05,39.48) v1(52.22,39.48) v1(57.59,39.48) v1(62.61,39.48) v1(69.48,39.48) v1(75.58,39.48) v1(82.91,39.48) v1(92.43,39.48) v1(97.25,39.48) 98.82,39.48 98.82,41.83 ; 2.92,81.71 2.92,66.28 ; v1(1.14,37.01) 1.14,81.78 ; 14.99,73.58 14.99,75.43 ; 6.64,83.24 CN2.2 ; 4.7,79.17 4.7,81.65
  vias: v1(1.14,27.99) v1(1.14,22.91) v1(1.14,17.83) v1(4.42,92.04) v1(4.42,88.23) v1(4.42,84.42) v1(4.42,46.51) v1(4.42,42.7) v1(4.51,54.03) v1(7.56,54.03) v1(8.11,66.26) v1(8.76,37.01) v1(8.76,35.1) v1(8.99,88.23) v1(8.99,84.42) v1(10.6,54.03) v1(10.72,67.67) v1(11.3,37.01) v1(11.3,35.1) v1(11.3,33.2) v1(11.99,67.67) v1(12.04,42.7) v1(12.95,66.22) v1(13.27,37.01) v1(13.27,33.2) v1(15.09,57.96) v1(15.68,67.67) v1(15.85,50.32) v1(15.85,46.51) v1(16.76,85.9) v1(16.95,67.67) v1(17.34,85.33) v1(17.63,66.09) v1(18.9,66.09) v1(18.9,63.04) v1(18.9,60.5) v1(18.9,57.96) v1(18.9,54.15) v1(18.9,51.61) v1(18.9,49.07) v1(18.9,46.53) v1(20.64,94.22) v1(20.64,91.68) v1(21.46,37.01) v1(21.46,35.1) v1(21.46,33.2) v1(22.26,84.58) v1(22.26,83.41) v1(23.15,50.95) v1(23.15,45.87) v1(23.15,41.3) v1(23.46,84.56) v1(23.46,83.41) v1(25.58,91.15) v1(25.69,41.3) v1(28.23,41.3) v1(28.51,66.34) v1(28.61,50.95) v1(29.84,92.44) v1(30.77,41.3) v1(31.05,66.34) v1(31.15,50.95) v1(31.27,74.41) v1(32.32,76.63) v1(32.58,62.34) v1(32.89,86.7) v1(32.89,84.51) v1(33.11,74.41) v1(33.31,41.3) v1(33.59,66.34) v1(33.97,46.76) v1(34.16,37.01) v1(34.28,87.78) v1(34.28,85.59) v1(34.28,83.4) v1(35.12,62.34) v1(35.85,41.3) v1(36.13,66.34) v1(36.7,37.01) v1(37.4,76.63) v1(38.09,87.78) v1(38.09,83.4) v1(38.07,54.76) v1(38.61,49.14) v1(38.67,66.34) v1(39.24,37.01) v1(39.88,74.41) v1(42.54,81.14) v1(43.15,54.76) v1(43.15,50.95) v1(43.56,93.4) v1(45.21,46.6) v1(47.69,41.26) v1(49.52,91.59) v1(50.99,76.44) v1(50.99,69.71) v1(51.05,60.74) v1(51.05,58.2) v1(51.05,55.66) v1(53.33,91.59) v1(55.85,56.03) v1(55.85,53.49) v1(55.85,50.95) v1(56.25,69.37) v1(57.14,75.34) v1(60.52,58.92) v1(60.95,87.78) v1(60.95,83.97) v1(60.95,81.05) v1(60.95,77.24) v1(61.5,45.07) v1(62.61,57.71) v1(62.85,91.59) v1(64.04,45.07) v1(64.76,87.78) v1(64.76,83.97) v1(64.76,81.05) v1(64.76,77.24) v1(65.72,45.07) v1(67.03,57.71) v1(68.57,87.78) v1(68.57,83.97) v1(68.57,81.05) v1(68.57,77.24) v1(70.23,45.14) v1(71.11,81.05) v1(73.57,91.3) v1(73.57,88.76) v1(73.57,81.14) v1(73.85,77.01) v1(74.1,42.72) v1(76.41,34.48) v1(76.41,33.21) v1(76.41,31.94) v1(76.41,30.67) v1(76.41,29.4) v1(76.41,28.13) v1(76.77,58.09) v1(79.06,58.09) v1(80,93.16) v1(80.45,61.71) v1(80.9,34.53) v1(80.9,33.26) v1(80.9,31.99) v1(80.9,30.72) v1(80.9,29.45) v1(80.9,28.18) v1(80.9,26.91) v1(80.9,25.64) v1(81.47,66.15) v1(81.6,58.09) v1(83.06,51.49) v1(83.06,48.95) v1(83.06,42.72) v1(83.33,89.48) v1(83.33,87.17) v1(83.33,85.16) v1(84.01,66.15) v1(84.14,58.09) v1(85.16,42.72) v1(85.6,51.49) v1(85.6,49.58) v1(86.55,66.15) v1(88.58,92.04) v1(88.58,88.67) v1(90.14,43.42) v1(91.32,75.98) v1(91.38,66.09) v1(91.95,64.95) v1(92.3,57.71) v1(92.27,33.26) v1(92.39,62.73) v1(92.39,61.6) v1(92.68,43.42) v1(94.42,57.71) v1(95.12,87.62) v1(95.12,85.08) v1(95.22,43.42) v1(95.63,62.26) v1(95.63,59.74) v1(97.66,87.62) v1(97.66,85.08) v1(98.36,68.11) v1(98.36,65.57) v1(98.36,63.28) v1(98.36,60.74) v1(98.36,58.2) v1(98.36,54.04) v2(25.97,74.16) v2(27.74,67.49) v2(29.53,54.6) v2(30.6,62.34) v2(33.59,50.34) v2(33.97,44.31)
#LOAD_EN_PRI: length 17.1
  Top Layer w0.254: v1(25.91,81.27) 24.38,81.27 23.86,81.79 U1.10
  Bottom Layer w0.254: v1(25.91,81.27) 25.97,81.33 29.65,81.33 32.38,78.6 Q4.1
  Bottom Layer w0.508: Q4.1 35.3,78.6 35.62,78.28 37.34,78.28 37.66,78.6 Q3.1
#LOAD_EN_SEC: length 45.1
  Top Layer w0.254: U1.9 23.36,81.59 24.27,80.68 v1(26.42,80.68)
  Top Layer w0.508: v1(48.17,86.41) 49.34,85.24 49.34,78.58 v1(48.15,77.39)
  Bottom Layer w0.254: v1(26.42,80.68) 29.54,80.68 32.83,77.39 41.21,77.39 42.42,78.6 43.99,78.6
  Bottom Layer w0.508: Q5.1 47.11,86.09 47.43,86.41 v1(48.17,86.41) 49.15,86.41 49.47,86.09 Q6.1 ; Q2.1 45.34,78.6 45.66,78.28 47.37,78.28 47.69,78.6 Q1.1 48.79,78.03 v1(48.15,77.39)
#LORA_RES: length 16
  Top Layer w0.254: 82.93,72.82 82.93,81.58 81.36,83.16 U12.6
+VGG: length 58.6
  Top Layer w1.27: R25.2 49.17,17.32 45.55,20.94 R23.2 ; 45.41,21.02 45.42,21 45.4,20.99 31.38,20.99 30.92,20.53 D5.1
AUX_BATT+: length 55.2
  Top Layer w0.254: v1(26.03,84.72) 25.82,84.5 U1.14
  Top Layer w0.508: v1(27.5,86.16) 27.5,87.98 ; 27.5,87.98 27.5,88.04 27.52,88.06 ; 27.5,87.98 27.39,88.09 27.39,90.47 ; 27.5,87.98 C1.2 ; v1(22.86,75.36) 15.18,75.36 12.7,77.84 12.7,83.74 10.67,85.78 6.67,85.78
  Bottom Layer w0.508: 26.03,82.66 22.86,79.49 v1(22.86,75.36) ; 26.03,82.66 26.03,83.43 ; 26.03,82.66 26.42,83.05 ; 26.03,83.43 v1(26.03,84.72) 27.47,86.16 v1(27.5,86.16) ; 26.03,83.43 26.42,83.05 ; 26.42,83.05 29.21,83.05 32.7,79.55 Q4.3
CS: length 46.5
  Top Layer w0.254: v1(93.37,67.51) 93.37,60.66 90.55,57.84 U11.18 ; U12.5 v1(79.12,85.16)
  Bottom Layer w0.254: v1(93.37,67.51) 82.33,67.51 79.12,70.73 v1(79.12,85.16)
GEIG_PULSE: length 47
  Top Layer w0.254: Q15.3 85.13,32.05 85.6,32.51 88.96,32.51 D6.1 89.15,32.35 89.15,34.8 ; U11.19 88.01,52.69 89.15,51.55 98.3,51.55 99.44,50.41 99.44,41.52 98.3,40.37 90.3,40.37 89.13,39.2 R26.1
HV_DIR: length 77
  Top Layer w0.508: v1(47.69,43.17) 66.17,43.17 67.69,44.69 R35.2
  Bottom Layer w0.508: CN4.2 10.16,59.42 12.83,56.76 12.83,47.23 16.89,43.17 v1(47.69,43.17)
HV_SPD: length 71.8
  Top Layer w0.508: 72.77,47.79 72.77,44.69 70.42,42.34 v1(47.69,42.34)
  Bottom Layer w0.508: CN5.2 12.64,46.22 16.51,42.34 v1(47.69,42.34)
I2C_SCL: length 33.1
  Top Layer w0.254: v1(83.69,62.21) 84.93,60.97 v1(88.35,60.97) ; v1(75.31,75.93) 75.31,72.82
  Bottom Layer w0.254: U7.1 88.35,59.65 v1(88.35,60.97) 88.73,61.35 U6.6 ; R32.1 v1(75.31,75.93) 77.22,74.03 77.22,66.98 81.99,62.21 v1(83.69,62.21)
I2C_SDA: length 31.5
  Top Layer w0.254: v1(77.79,75.93) 77.79,72.89 U11.8
  Bottom Layer w0.254: U6.1 82.23,62.79 77.79,67.23 v1(77.79,75.93) 75.56,78.16 72.09,78.16 R31.1 ; 85.7,62.79 85.63,62.73 85.63,61.38 85.99,61.02 U7.8
LOGIC_VCC_UNREG: length 80.7
  Top Layer w0.254: U4.3 v1(38.25,45.41)
  Top Layer w0.508: 32.31,47.99 32.33,47.98 32.46,48.11 v1(34.33,48.11) U4.6 ; 32.31,47.99 32.26,48.05 ; 32.31,47.99 L4.1 26.38,47.99 C24.2
  Top Layer w0.762: 46.8,79.55 46.8,78.8 ; 46.8,79.55 47.55,79.55 ; 46.8,79.55 46.05,79.55 ; 46.8,78.8 46.05,79.55 ; 46.8,78.8 46.8,66.22 47.56,65.46 47.56,55.04 45.72,53.2 v1(44.89,53.2) v1(43.24,53.2) ; 46.8,78.8 47.55,79.55 ; 47.55,79.55 v1(48.01,79.55) ; 46.05,79.55 v1(43.04,79.55) ; v1(26.25,51.62) v1(26.25,50.79) v1(26.25,50.01) C24.2 ; 29.35,48.13 L4.1
  Bottom Layer w0.254: v1(38.25,45.41) 35.55,48.11 v1(34.33,48.11)
  Bottom Layer w0.508: 40.98,79.55 v1(43.04,79.55) ; Q2.3 v1(48.01,79.55)
  Bottom Layer w0.762: v1(26.25,50.01) v1(26.25,50.79) v1(26.25,51.62) 27.83,53.2 v1(43.24,53.2) 44.89,53.2
  vias: v1(44.07,53.2)
MIC_OUT: length 26
  Top Layer w0.254: v1(76.07,66.48) 76.08,66.48 80.39,70.79 U11.7
  Bottom Layer w0.254: U9.1 77.43,52.1 76.07,53.45 v1(76.07,66.48)
  Bottom Layer w0.508: U9.2 U9.1
MISO: length 53.9
  Top Layer w0.254: v1(94.92,69.44) 94.92,58.55 95.63,57.84 U11.16 ; U12.2 76.34,91.17 v1(81.34,91.17)
  Bottom Layer w0.254: v1(94.92,69.44) 83.26,69.44 81.34,71.36 v1(81.34,91.17)
MOSI: length 51
  Top Layer w0.254: v1(94.15,68.81) 94.15,58.83 93.15,57.84 93.15,55.11 93.09,55.04 ; U12.3 76.34,89.14 v1(80.58,89.14)
  Bottom Layer w0.254: v1(80.58,89.14) 80.58,71.17 82.94,68.81 v1(94.15,68.81)
MPPT_VBAT_OK: length 83
  Top Layer w0.254: U1.13 26.66,84 v1(26.75,84.09) ; U11.20 85.47,58.09 80.52,63.04 66.04,63.04 62.29,66.79 v1(57,66.79) ; v1(52.13,82.09) v1(52.13,69.71)
  Bottom Layer w0.254: v1(57,66.79) 53.47,66.79 52.13,68.12 v1(52.13,69.71) ; v1(26.75,84.09) 31.28,84.09 33.27,82.09 v1(52.13,82.09)
PANEL+: length 26.8
  Top Layer w0.254: U1.2 19.75,84.5 v1(19.18,85.08)
  Top Layer w0.508: 11.81,93.06 12.34,93.59 ; 11.81,93.06 11.28,93.59 ; 11.81,93.06 11.81,91.81
  Top Layer w0.762: C8.2 15.47,86.39 v1(15.47,87.89) L1.1 15.47,93.59 9.84,93.59 9.08,92.82 6.67,92.82
  Bottom Layer w0.508: v1(15.47,87.89) 16.36,87.89 v1(19.18,85.08)
POWER_VCC_UNREG: length 81.7
  Top Layer w0.254: U3.3 v1(24.45,73.08)
  Top Layer w0.508: 32.26,69.15 C18.2 29.31,69.04 v1(27.74,69.04) U3.6 ; L2.2 38.25,57.07 34.81,57.07 C14.2 C13.2 29.29,56.96 29.26,56.94
  Top Layer w0.762: 45.21,68.72 45.21,65.77 46.1,64.88 46.1,58.41 45.21,57.52 43.46,57.52 C15.2 43.26,57.72 L2.2 ; 45.21,68.72 44.56,69.38 ; 45.21,68.72 45.21,70.03 ; 35.32,69.38 C19.2 ; C19.2 35.27,69.51 L3.1 ; C19.2 44.56,69.38 ; 44.56,69.38 45.21,70.03 ; 45.21,70.03 45.21,77.01 44.2,78.03 42.67,78.03 41.53,79.17 41.53,84.12 42.54,85.14 v1(47.37,85.14)
  Bottom Layer w0.254: v1(27.74,69.04) 25.82,69.04 24.45,70.41 24.45,73.07 v1(24.45,73.08)
  Bottom Layer w0.508: 48.56,85.14 v1(47.37,85.14)
SCK: length 41.3
  Top Layer w0.254: U12.4 76.33,87.15 v1(79.84,87.15) ; U11.1 v1(95.63,68.16)
  Bottom Layer w0.254: v1(79.84,87.15) 79.84,70.96 82.64,68.16 v1(95.63,68.16)
SERVO_CTRL: length 80.2
  Top Layer w0.254: 75.31,55.04 75.31,58.09 73.15,60.25 64.58,60.25 60.65,64.18 v1(54.92,64.18)
  Bottom Layer w0.254: v1(54.92,64.18) 12.07,64.18 9.65,66.6 9.65,70.92 8.05,72.52 6.74,72.52 CN3.2
SERVO_EN: length 77.2
  Top Layer w0.254: v1(55.44,64.82) 61.08,64.82 64.96,60.95 74.99,60.95 77.85,58.09 U11.23
  Bottom Layer w0.254: Q11.1 13.04,70.65 R20.1 13.04,70.26 13.04,68.04 16.25,64.82 v1(55.44,64.82)
SERVO_GND: length 22.6
  Top Layer w0.508: v1(9.65,72.89) 11.6,72.89
  Top Layer w0.762: C4.1 11.68,72.59 11.68,73.71 10.29,75.11 CN3.3
  Bottom Layer w0.508: 8.55,75.36 8.55,75.33 8.78,75.11 ; 8.55,75.36 6.95,75.36 CN3.3 8.78,75.11 ; 8.55,75.36 10.92,75.36 11.18,75.11 ; Q11.3 11.18,75.11 ; 11.18,75.11 9.56,75.11 ; 9.17,75.11 9.17,74.72 ; 9.17,75.11 9.56,75.11 ; 9.17,75.11 8.78,75.11 ; 9.17,74.72 9.17,73.37 v1(9.65,72.89) ; 9.17,74.72 9.56,75.11 ; 9.17,74.72 8.78,75.11
UART_RX: length 37.9
  Top Layer w0.254: v1(72.77,69.2) U11.10
  Bottom Layer w0.254: 66.94,41.07 66.94,47.72 65.79,48.88 65.79,52.63 71.75,58.6 71.75,67.23 72.77,68.25 v1(72.77,69.2)
  Bottom Layer w0.508: R37.1 66.94,41.07
UART_TX: length 28.5
  Top Layer w0.254: v1(70.17,69.2) 70.17,72.76 U11.11
  Bottom Layer w0.254: 65.19,47.23 65.19,52.86 71.18,58.85 71.18,67.23 70.17,68.25 v1(70.17,69.2)
WIND_DIR: length 38.2
  Top Layer w0.254: v1(74.55,51.04) 70.8,51.04 70.23,50.47 R33.2 ; U11.5 85.47,70.66 84.39,69.58 80.14,69.58 76.33,65.77 v1(74.49,65.77)
  Top Layer w0.512: R35.1 R33.2
  Bottom Layer w0.254: v1(74.49,65.77) 74.49,51.1 v1(74.55,51.04)
WIND_SPD: length 35.5
  Top Layer w0.254: R34.2 v1(75.31,51.55) ; U11.4 88.01,70.66 86.36,69.01 80.45,69.01 76.58,65.14 v1(75.31,65.14)
  Top Layer w0.512: R36.1 R34.2
  Bottom Layer w0.254: v1(75.31,65.14) 75.31,51.55
$2N5941: length 10.6
  Top Layer w0.254: v1(19.18,79.3) 19.17,79.29 R1.2 R2.1 ; v1(19.18,84.25) 19.42,84 U1.3
  Bottom Layer w0.254: v1(19.18,79.3) v1(19.18,84.25)
$2N7577: length 3.1
  Top Layer w0.762: L1.2 18.57,88.63
$2N8110: length 5
  Bottom Layer w0.508: Q1.2 47.69,80.5 47.37,80.82 45.66,80.82 45.34,80.5 Q2.2
$2N8222: length 5
  Bottom Layer w0.508: Q4.2 35.3,80.5 35.62,80.82 37.34,80.82 37.66,80.5 Q3.2
$2N10317: length 7.8
  Top Layer w0.254: 23.91,78.03 24.15,77.78 ; 23.91,78.03 23.67,77.78 ; 23.91,78.03 23.91,80.34 22.86,81.39 U1.8 ; 23.91,78.03 23.91,77.78 ; 24.15,77.78 24.96,77.78 R5.2 ; 24.15,77.78 23.91,77.78 ; 23.67,77.78 23.91,77.78 ; 23.67,77.78 R3.1
$2N10326: length 5.4
  Top Layer w0.254: R4.1 R3.2 22.86,79.3 22.86,80.63 22.36,81.13 U1.7
$2N10596: length 7.7
  Top Layer w0.254: R5.1 R6.2 27.09,81.93 26.01,83 U1.11
$2N10600: length 11.5
  Top Layer w0.254: 28.14,77.8 28.42,77.8 ; 28.14,77.8 27.86,77.8 ; 28.14,77.8 28.14,78.08 ; 28.42,77.8 28.14,78.08 ; 28.42,77.8 R7.1 ; 27.86,77.8 R6.1 ; 27.86,77.8 28.14,78.08 ; 28.14,78.08 28.14,82.34 26.97,83.5 U1.12
$2N12892: length 3.7
  Top Layer w0.254: C10.1 17.85,83.84 18.51,83.84 18.84,83.5 U1.4
$2N21137: length 5
  Bottom Layer w0.508: Q6.2 49.47,84.19 49.15,83.87 47.43,83.87 47.11,84.19 Q5.2
$2N24422: length 50.8
  Top Layer w0.254: U1.18 22.86,86.41 v1(23.24,86.79) v1(24.26,86.79)
  Top Layer w1.524: 59.04,91.37 56.43,88.76 40.84,88.76 SC1.1
  Bottom Layer w0.762: 36.33,91.37 35.63,91.37 ; 36.33,91.37 SC1.1 ; 36.33,91.37 35.63,90.67 ; 35.63,91.37 35.63,90.67 ; 35.63,91.37 34.93,91.37 ; 35.63,90.67 35.63,89.26 36.78,88.11 F1.1 ; 35.63,90.67 34.93,91.37 ; v1(23.24,86.79) v1(24.26,86.79) 28.84,91.37 34.93,91.37
$2N29897: length 2.1
  Top Layer w0.254: R7.2 29.21,79.32 R8.1
$2N33209: length 66.8
  Top Layer w0.254: U1.19 22.36,86.72 ; 22.36,86.72 22.36,88.37 22.35,88.38 22.29,88.32 v1(22.29,86.79) 22.36,86.72 ; R2.2 15.68,76.95 16.31,76.32 v1(16.7,76.32)
  Top Layer w0.508: 22.35,88.38 22.35,93.14 C9.2 v1(23.94,93.33)
  Bottom Layer w0.254: v1(16.7,76.32) 18.3,76.32 20.45,78.47 20.45,84.95 v1(22.29,86.79)
  Bottom Layer w0.508: R9.1 55.75,81.9 55.25,82.41 55.25,85.84 52.2,88.89 44.58,88.89 40.13,93.33 23.94,93.33 v1(23.94,93.33)
$2N33226: length 26.4
  Bottom Layer w0.508: F1.2 39.67,86.84 40.64,87.81 43.31,87.81 ; 43.82,87.3 43.31,87.81 ; 43.82,87.3 44.33,87.81 ; 43.82,87.3 Q5.3 ; 43.31,87.81 44.33,87.81 ; 44.33,87.81 51.69,87.81 54.04,85.46 54.04,82.47 53.52,81.95 R10.1
$2N34228: length 5.1
  Bottom Layer w0.508: Q1.3 51.82,79.55 52.57,78.8 R10.2 R9.2
$3N6805: length 19.6
  Top Layer w0.762: 35.07,29.9 34.42,30.55 ; 35.07,29.9 34.42,29.24 ; 35.07,29.9 35.88,29.9 37.16,31.18 38.07,31.18 ; 35.07,29.9 33.88,29.9 Q13.2 ; 22.52,27.16 24.61,29.25 Q13.2 Q13.2 ; Q13.2 33.88,29.06
$3N8225: length 3.5
  Top Layer w0.762: D2.2 D1.1
$3N8233: length 4.5
  Top Layer w0.762: D3.2 D2.1
$3N8237: length 3.5
  Top Layer w0.762: D4.2 D3.1
$3N8334: length 19.5
  Top Layer w1.27: 18.62,20.53 17.77,19.68 ; 18.62,20.53 17.77,21.38 ; 18.62,20.53 D5.2 ; 17.77,19.68 17.77,21.38 ; 17.77,19.68 17.77,19.45 ; 17.77,21.38 17.77,24.12 14.74,27.16 12.02,27.16
$3N8590: length 10.6
  Top Layer w0.508: Q14.3 67.22,27.45 68.14,26.53 69.04,26.53 R22.1 71.76,26.55 C28.2 71.89,31.27 U5.1
$3N8761: length 7.2
  Top Layer w1.27: R23.1 R24.3
$3N8975: length 9.8
  Top Layer w0.508: Q14.1 63.4,28.4 63.06,28.06 C29.2 60.51,28.06 57.84,30.73 R24.2
$3N11491: length 3.3
  Top Layer w0.508: Q15.1 84.18,26.36 C30.1
$3N12768: length 5.8
  Top Layer w0.508: 55.92,33.27 R27.2
$3N22643: length 26.6
  Top Layer w0.762: 95.58,25.97 95.83,25.72 R25.1
  Top Layer w1.27: CN6.1 CN6.1 95.8,17.26 95.86,17.32
$3N22647: length 4.6
  Top Layer w0.762: C31.1 C30.2
$3N24445: length 6
  Top Layer w0.508: Q13.1 27.94,34.84 R28.1 27.94,34.86 R29.1
$3N24449: length 39
  Top Layer w0.508: v1(33.91,34.85) 32.14,34.85 R29.2 ; v1(69.15,34.85) 69.15,33.34 U5.4
  Bottom Layer w0.508: v1(33.91,34.85) 53.59,34.85 53.97,35.23 57.78,35.23 58.17,34.85 v1(69.15,34.85)
$3N29810: length 11.6
  Top Layer w0.508: 69.06,28.06 69.09,28.08 v1(69.09,29.97) U5.6 ; U5.3 v1(73.28,33.27)
  Bottom Layer w0.508: v1(69.09,29.97) 72.15,29.97 73.28,31.1 v1(73.28,33.27)
$4N2106: length 13.9
  Top Layer w0.508: U8.1 v1(85.09,47.25)
  Bottom Layer w0.508: U9.3 79.95,50.42 79.95,48.56 81.26,47.25 R30.1 v1(85.09,47.25)
$4N5820: length 2.8
  Bottom Layer w0.254: U7.4 C37.2
$4N12930: length 6.2
  Bottom Layer w0.508: U10.2 62.68,47.22 R37.2
$5N3100: length 7.1
  Top Layer w0.254: R12.1 26.66,61.67 R11.2 26.65,61.64 26.65,60.88 27.36,60.17 27.36,59.23
$5N3103: length 10.8
  Top Layer w0.508: L2.1 38.9,60.82 30.01,60.82 29.26,60.07 29.26,59.23
$5N15814: length 6.2
  Top Layer w0.508: U3.1 26.35,72 32.11,72 L3.2
$5N16968: length 6
  Top Layer w0.508: U4.1 29.73,45.41 29.49,45.66
$5N17039: length 4.8
  Top Layer w0.508: U4.4 37.29,50.82 R15.2 R16.1
$5N17077: length 4.6
  Top Layer w0.254: R13.2 R14.1
  Top Layer w0.508: R13.2 24.46,69.03 U3.4
$6N1191: length 5.6
  Top Layer w0.508: U12.9 ANT1.1
$7N615: length 5.1
  Bottom Layer w0.508: 55.64,71.72 54.71,71.72 54.51,71.92 R17.2 52.67,71.92 51.92,72.67 Q9.3
$7N629: length 5.1
  Bottom Layer w0.508: Q10.1 43.18,71.74 42.98,71.94 R19.2 41.01,71.94 40.26,72.69 Q12.3

## Copper pours and planes (outline as drawn; the poured copper is in the pictures)
GND on Top Layer: 73.91,45.07 67.63,38.79 2.29,38.79 2.29,66.69 14.26,66.69 17.14,63.8 17.14,44.95 21.97,40.12 49.53,40.12 54.18,44.77 54.18,76.01 60.14,81.97 70.29,81.97 72.58,84.25 72.58,94.98 100,94.98 100,83.74 95.05,83.74 92.38,81.08 92.38,77.28 95.06,74.6 100,74.6 100,53.14 75.94,53.14 73.91,51.11
GND on Top Layer: 13.02,78.73 10.22,78.73 8.45,80.51 0,80.51 0,94.98 71.63,94.98 71.95,94.67 71.95,84.38 70.03,82.46 59.89,82.46 53.67,76.25 32.01,76.25 31.12,77.14 31.12,83.36 29.65,84.82 19.11,84.82 18.51,84.22 18.51,82.25 17.91,81.65 13.53,81.65 13.02,81.14
GND on Top Layer: 22.1,40.69 17.65,45.14 17.65,64 14.48,67.17 0,67.17 0,79.99 8.19,79.99 13.97,74.22 23.05,74.22 24.57,75.74 53.51,75.74 53.51,44.86 49.34,40.69
GND on Top Layer: 82.99,28.44 99.99,28.44 100,28.43 100,37.77 79.44,37.77 79.44,21.91 92.76,21.91 92.76,23.48 82.99,23.48 81.98,24.5 81.98,27.42
GND on Top Layer: 74.42,50.98 76.07,52.63 100,52.63 100,38.79 67.56,38.79 68.86,40.08 69.56,40.08 74.42,44.95
GND on Top Layer: 7.75,26.59 10.16,24.18 13.97,24.18 15.24,22.91 15.24,16.12 0,16.12 0,37.77 78.18,37.77 78.18,21.89 59.69,21.89 59.69,34.02 58.23,35.48 53.21,35.48 51.82,34.09 25.72,34.09 23.05,31.42 9.97,31.42 7.75,29.2
GND on Bottom Layer: 74.42,50.98 76.07,52.63 100,52.63 100,38.79 67.56,38.79 68.86,40.08 69.56,40.08 74.42,44.95
GND on Bottom Layer: 73.91,45.07 67.63,38.79 2.29,38.79 2.29,66.69 14.26,66.69 17.14,63.8 17.14,44.95 21.97,40.12 49.53,40.12 54.18,44.77 54.18,76.01 60.14,81.97 70.29,81.97 72.58,84.25 72.58,94.98 100,94.98 100,83.74 95.05,83.74 92.38,81.08 92.38,77.28 95.06,74.6 100,74.6 100,53.14 75.94,53.14 73.91,51.11
GND on Bottom Layer: 22.1,40.69 17.65,45.14 17.65,64 14.48,67.17 0,67.17 0,79.99 8.19,79.99 13.97,74.22 23.05,74.22 24.57,75.74 53.45,75.74 53.45,44.8 49.34,40.69
GND on Bottom Layer: 0,94.98 71.97,94.98 71.97,84.41 70.03,82.46 59.89,82.46 53.68,76.25 24.38,76.25 22.86,74.73 14.22,74.73 8.44,80.51 0,80.51
GND on Bottom Layer: 0,37.77 100,37.77 100,16.12 0,16.12
$2N7577 on Top Layer: 20.75,86.43 19.49,87.68 19.49,94.03 17.59,94.03 17.59,87.24 19.37,85.46 22,85.46 22,86.19 21.76,86.43

## Text on the board
Bottom Silkscreen Layer: DESIGNED BY: / GIORGIO SCACCHIERO / CRISTIAN PICCONE / GIACOMO PASCON | JLCJLCJLCJLC | REV. 1 - 21/09/25
Top Silkscreen Layer: PN- | AB- | GND | CTL | DIR | AGN | SPD | PN+ | AB+ | 5V | 25V | HIGH | VOLTAGE | SIDE | + | -
